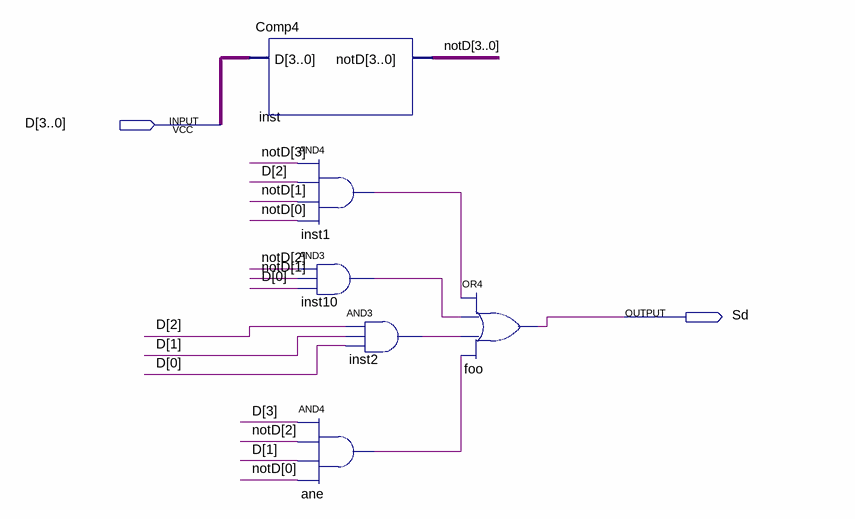
[diagram p0: schematic sheet]
// Quartus schematic Sd.bdf as structural Verilog: 6 symbols, 2 pins
module Sd (
  input  [3:0] D,
  output Sd
);

  wire ane_out, inst1_out, inst2_out, inst10_out;
  wire [3:0] notD;

  Comp4 inst (.D(D), .notD(notD));
  and inst1 (inst1_out, notD[3], D[2], notD[1], notD[0]);
  and inst10 (inst10_out, notD[2], notD[1], D[0]);
  and ane (ane_out, D[3], notD[2], D[1], notD[0]);
  and inst2 (inst2_out, D[2], D[1], D[0]);
  or foo (Sd, inst1_out, inst10_out, inst2_out, ane_out);
endmodule
